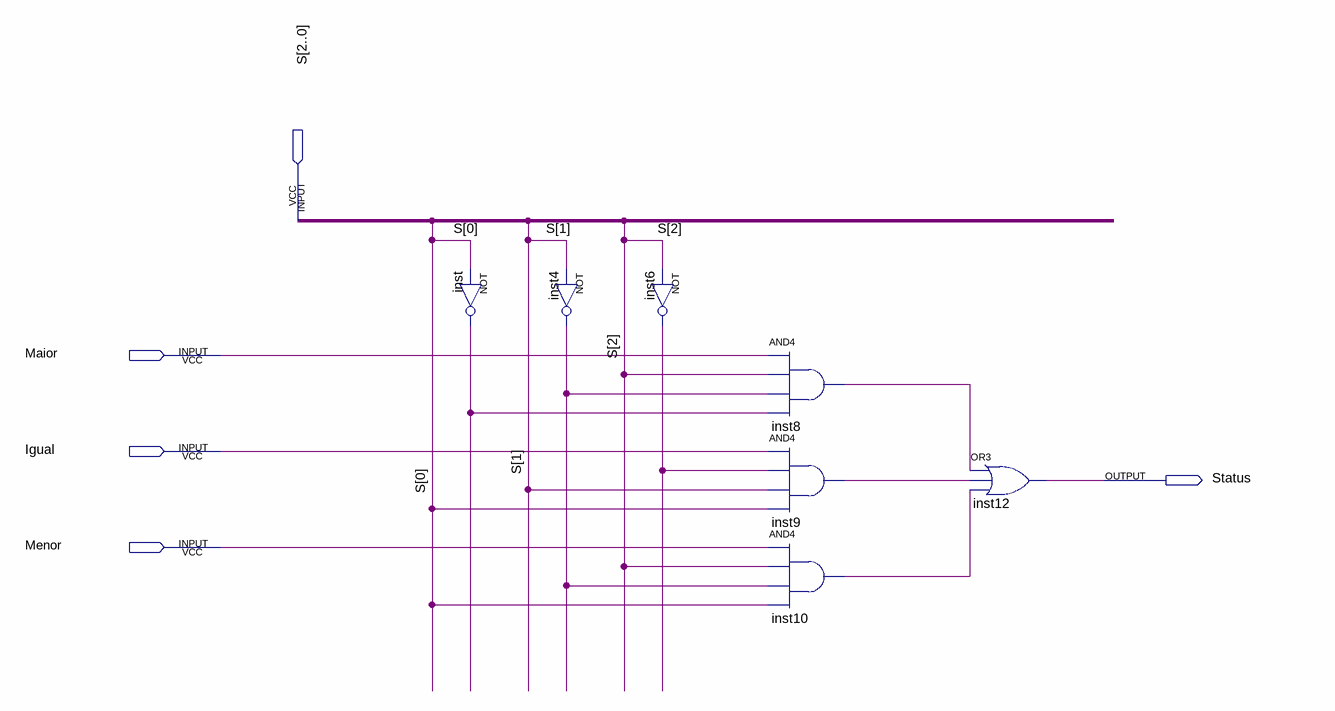
[diagram p0: schematic sheet]
// Quartus schematic mux1Bit.bdf as structural Verilog: 7 symbols, 5 pins
module mux1Bit (
  input  [2:0] S,
  input  Maior,
  input  Igual,
  input  Menor,
  output Status
);

  wire inst4_out, inst6_out, inst8_out, inst9_out, inst10_out, inst_out;

  not inst (inst_out, S[0]);
  not inst4 (inst4_out, S[1]);
  not inst6 (inst6_out, S[2]);
  and inst8 (inst8_out, Maior, S[2], inst4_out, inst_out);
  and inst9 (inst9_out, Igual, inst6_out, S[1], S[0]);
  and inst10 (inst10_out, Menor, S[2], inst4_out, S[0]);
  or inst12 (Status, inst8_out, inst9_out, inst10_out);
endmodule
